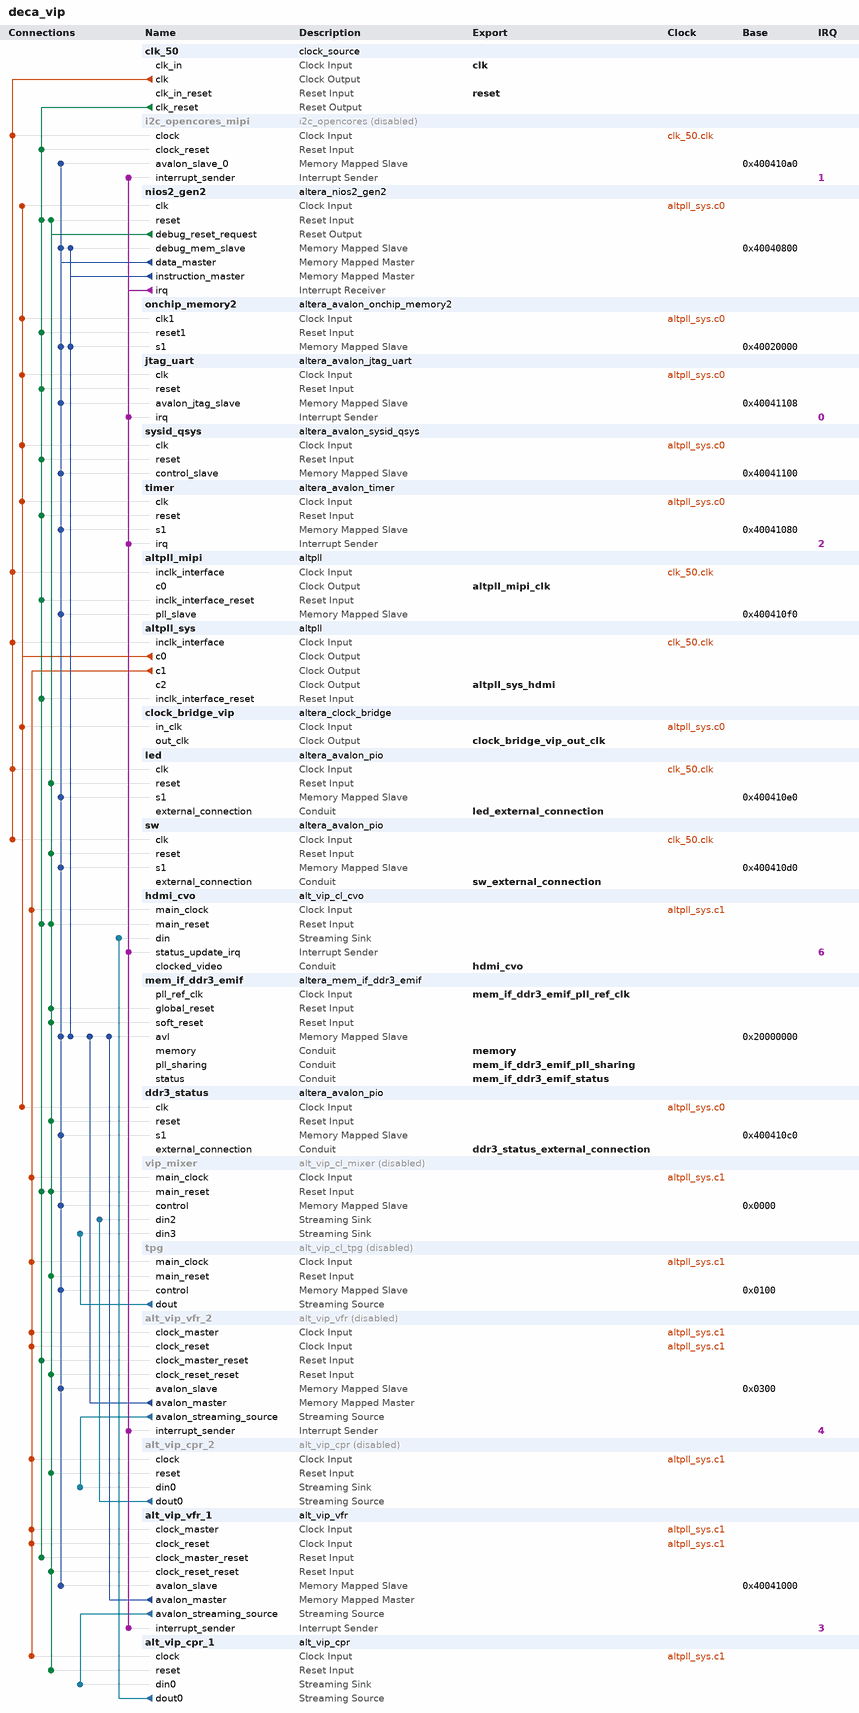
[diagram p0: system contents]
# Platform Designer (Qsys) system deca_vip, MAX 10 10M50DAF484C6GES
# Parameters at their usual value, and those the tool derives, are not listed.
package require -exact qsys 15.0
create_system deca_vip
set_project_property DEVICE_FAMILY {MAX 10}
set_project_property DEVICE 10M50DAF484C6GES

add_instance clk_50 clock_source 15.0
set_instance_parameter_value clk_50 clockFrequency 50000000

add_instance i2c_opencores_mipi i2c_opencores 12.0
set_instance_property i2c_opencores_mipi ENABLED false

add_instance nios2_gen2 altera_nios2_gen2 15.0
set_instance_parameter_value nios2_gen2 dcache_size 2048
set_instance_parameter_value nios2_gen2 exceptionSlave onchip_memory2.s1
set_instance_parameter_value nios2_gen2 icache_size 4096
set_instance_parameter_value nios2_gen2 impl Fast
set_instance_parameter_value nios2_gen2 resetSlave onchip_memory2.s1

add_instance onchip_memory2 altera_avalon_onchip_memory2 15.0
set_instance_parameter_value onchip_memory2 dataWidth 32
set_instance_parameter_value onchip_memory2 dualPort false
set_instance_parameter_value onchip_memory2 initMemContent false
set_instance_parameter_value onchip_memory2 initializationFileName "E:\\SVN\\deca\\amax10\\test\\richard\\DECA_MIPI\\software\\deca_mipi\\mem_init\\deca_qsys_onchip_memory2.hex"
set_instance_parameter_value onchip_memory2 memorySize 70000

add_instance jtag_uart altera_avalon_jtag_uart 15.0
set_instance_parameter_value jtag_uart simInteractiveOptions NO_INTERACTIVE_WINDOWS

add_instance sysid_qsys altera_avalon_sysid_qsys 15.0
set_instance_parameter_value sysid_qsys id 0

add_instance timer altera_avalon_timer 15.0
set_instance_parameter_value timer period 1
set_instance_parameter_value timer periodUnits MSEC

add_instance altpll_mipi altpll 15.0
set_instance_parameter_value altpll_mipi CLK0_DIVIDE_BY 25
set_instance_parameter_value altpll_mipi CLK0_MULTIPLY_BY 12
set_instance_parameter_value altpll_mipi INCLK0_INPUT_FREQUENCY 20000
set_instance_parameter_value altpll_mipi PORT_ARESET PORT_UNUSED
set_instance_parameter_value altpll_mipi PORT_LOCKED PORT_USED
set_instance_parameter_value altpll_mipi PORT_clk1 PORT_UNUSED
set_instance_parameter_value altpll_mipi PORT_clk2 PORT_UNUSED
set_instance_parameter_value altpll_mipi PORT_clk3 PORT_UNUSED

add_instance altpll_sys altpll 15.0
set_instance_parameter_value altpll_sys CLK0_DIVIDE_BY 1
set_instance_parameter_value altpll_sys CLK0_MULTIPLY_BY 2
set_instance_parameter_value altpll_sys CLK1_DIVIDE_BY 1
set_instance_parameter_value altpll_sys CLK1_DUTY_CYCLE 50
set_instance_parameter_value altpll_sys CLK1_MULTIPLY_BY 2
set_instance_parameter_value altpll_sys CLK1_PHASE_SHIFT 0
set_instance_parameter_value altpll_sys CLK2_DIVIDE_BY 3
set_instance_parameter_value altpll_sys CLK2_DUTY_CYCLE 50
set_instance_parameter_value altpll_sys CLK2_MULTIPLY_BY 5
set_instance_parameter_value altpll_sys CLK2_PHASE_SHIFT 0
set_instance_parameter_value altpll_sys INCLK0_INPUT_FREQUENCY 20000
set_instance_parameter_value altpll_sys PORT_ARESET PORT_UNUSED
set_instance_parameter_value altpll_sys PORT_LOCKED PORT_USED
set_instance_parameter_value altpll_sys PORT_clk1 PORT_USED
set_instance_parameter_value altpll_sys PORT_clk2 PORT_USED
set_instance_parameter_value altpll_sys PORT_clk3 PORT_UNUSED

add_instance clock_bridge_vip altera_clock_bridge 15.0
set_instance_parameter_value clock_bridge_vip DERIVED_CLOCK_RATE 100000000
set_instance_parameter_value clock_bridge_vip EXPLICIT_CLOCK_RATE 100000000

add_instance led altera_avalon_pio 15.0
set_instance_parameter_value led direction Output
set_instance_parameter_value led width 8

add_instance sw altera_avalon_pio 15.0
set_instance_parameter_value sw direction Input
set_instance_parameter_value sw width 2

add_instance hdmi_cvo alt_vip_cl_cvo 15.0
set_instance_parameter_value hdmi_cvo ACCEPT_COLOURS_IN_SEQ 0
set_instance_parameter_value hdmi_cvo ANC_LINE 0
set_instance_parameter_value hdmi_cvo AP_LINE 0
set_instance_parameter_value hdmi_cvo BPS 8
set_instance_parameter_value hdmi_cvo CLOCKS_ARE_SAME 0
set_instance_parameter_value hdmi_cvo COLOUR_PLANES_ARE_IN_PARALLEL 1
set_instance_parameter_value hdmi_cvo CONTEXT_WIDTH 8
set_instance_parameter_value hdmi_cvo DST_WIDTH 8
set_instance_parameter_value hdmi_cvo FIELD0_ANC_LINE 0
set_instance_parameter_value hdmi_cvo FIELD0_V_BACK_PORCH 0
set_instance_parameter_value hdmi_cvo FIELD0_V_BLANK 0
set_instance_parameter_value hdmi_cvo FIELD0_V_FRONT_PORCH 0
set_instance_parameter_value hdmi_cvo FIELD0_V_RISING_EDGE 0
set_instance_parameter_value hdmi_cvo FIELD0_V_SYNC_LENGTH 0
set_instance_parameter_value hdmi_cvo FIFO_DEPTH 1280
set_instance_parameter_value hdmi_cvo F_FALLING_EDGE 0
set_instance_parameter_value hdmi_cvo F_RISING_EDGE 0
set_instance_parameter_value hdmi_cvo GENERATE_SYNC 0
set_instance_parameter_value hdmi_cvo H_ACTIVE_PIXELS 1280
set_instance_parameter_value hdmi_cvo H_BACK_PORCH 200
set_instance_parameter_value hdmi_cvo H_BLANK 0
set_instance_parameter_value hdmi_cvo H_FRONT_PORCH 64
set_instance_parameter_value hdmi_cvo H_SYNC_LENGTH 136
set_instance_parameter_value hdmi_cvo INTERLACED 0
set_instance_parameter_value hdmi_cvo NO_OF_CHANNELS 1
set_instance_parameter_value hdmi_cvo NO_OF_MODES 1
set_instance_parameter_value hdmi_cvo NUMBER_OF_COLOUR_PLANES 3
set_instance_parameter_value hdmi_cvo PIXELS_IN_PARALLEL 1
set_instance_parameter_value hdmi_cvo SRC_WIDTH 8
set_instance_parameter_value hdmi_cvo STD_WIDTH 1
set_instance_parameter_value hdmi_cvo TASK_WIDTH 8
set_instance_parameter_value hdmi_cvo THRESHOLD 1279
set_instance_parameter_value hdmi_cvo USE_CONTROL 0
set_instance_parameter_value hdmi_cvo USE_EMBEDDED_SYNCS 0
set_instance_parameter_value hdmi_cvo V_ACTIVE_LINES 800
set_instance_parameter_value hdmi_cvo V_BACK_PORCH 24
set_instance_parameter_value hdmi_cvo V_BLANK 0
set_instance_parameter_value hdmi_cvo V_FRONT_PORCH 1
set_instance_parameter_value hdmi_cvo V_SYNC_LENGTH 3

add_instance mem_if_ddr3_emif altera_mem_if_ddr3_emif 15.0
set_instance_parameter_value mem_if_ddr3_emif AVL_MAX_SIZE 4
set_instance_parameter_value mem_if_ddr3_emif CALIBRATION_MODE Skip
set_instance_parameter_value mem_if_ddr3_emif CPORT_TYPE_PORT Bidirectional,Bidirectional,Bidirectional,Bidirectional,Bidirectional,Bidirectional
set_instance_parameter_value mem_if_ddr3_emif EXPORT_AFI_HALF_CLK false
set_instance_parameter_value mem_if_ddr3_emif HARD_EMIF false
set_instance_parameter_value mem_if_ddr3_emif MEM_BANKADDR_WIDTH 3
set_instance_parameter_value mem_if_ddr3_emif MEM_CLK_FREQ 300.0
set_instance_parameter_value mem_if_ddr3_emif MEM_CLK_FREQ_MAX 800.0
set_instance_parameter_value mem_if_ddr3_emif MEM_COL_ADDR_WIDTH 10
set_instance_parameter_value mem_if_ddr3_emif MEM_DQ_WIDTH 16
set_instance_parameter_value mem_if_ddr3_emif MEM_FORMAT DISCRETE
set_instance_parameter_value mem_if_ddr3_emif MEM_ROW_ADDR_WIDTH 15
set_instance_parameter_value mem_if_ddr3_emif MEM_TCL 7
set_instance_parameter_value mem_if_ddr3_emif MEM_TFAW_NS 45.0
set_instance_parameter_value mem_if_ddr3_emif MEM_TRAS_NS 35.0
set_instance_parameter_value mem_if_ddr3_emif MEM_TRCD_NS 13.75
set_instance_parameter_value mem_if_ddr3_emif MEM_TRFC_NS 260.0
set_instance_parameter_value mem_if_ddr3_emif MEM_TRP_NS 13.75
set_instance_parameter_value mem_if_ddr3_emif MEM_TRRD_NS 7.5
set_instance_parameter_value mem_if_ddr3_emif MEM_TRTP_NS 7.5
set_instance_parameter_value mem_if_ddr3_emif MEM_TWTR 6
set_instance_parameter_value mem_if_ddr3_emif MEM_VENDOR Micron
set_instance_parameter_value mem_if_ddr3_emif MEM_WTCL 6
set_instance_parameter_value mem_if_ddr3_emif PLL_LOCATION Top_Bottom
set_instance_parameter_value mem_if_ddr3_emif POWER_OF_TWO_BUS true
set_instance_parameter_value mem_if_ddr3_emif PRIORITY_PORT 1,1,1,1,1,1
set_instance_parameter_value mem_if_ddr3_emif RATE Half
set_instance_parameter_value mem_if_ddr3_emif REF_CLK_FREQ 50.0
set_instance_parameter_value mem_if_ddr3_emif SPEED_GRADE 6
set_instance_parameter_value mem_if_ddr3_emif TIMING_BOARD_AC_SKEW 0.017
set_instance_parameter_value mem_if_ddr3_emif TIMING_BOARD_AC_TO_CK_SKEW -1.3E-4
set_instance_parameter_value mem_if_ddr3_emif TIMING_BOARD_DQ_TO_DQS_SKEW -6.0E-4
set_instance_parameter_value mem_if_ddr3_emif TIMING_BOARD_MAX_CK_DELAY 0.183
set_instance_parameter_value mem_if_ddr3_emif TIMING_BOARD_MAX_DQS_DELAY 0.181
set_instance_parameter_value mem_if_ddr3_emif TIMING_BOARD_SKEW_BETWEEN_DQS 0.005
set_instance_parameter_value mem_if_ddr3_emif TIMING_BOARD_SKEW_CKDQS_DIMM_MAX 0.007
set_instance_parameter_value mem_if_ddr3_emif TIMING_BOARD_SKEW_CKDQS_DIMM_MIN 0.002
set_instance_parameter_value mem_if_ddr3_emif TIMING_BOARD_SKEW_WITHIN_DQS 0.008
set_instance_parameter_value mem_if_ddr3_emif TIMING_TDH 55
set_instance_parameter_value mem_if_ddr3_emif TIMING_TDQSCK 225
set_instance_parameter_value mem_if_ddr3_emif TIMING_TDQSQ 125
set_instance_parameter_value mem_if_ddr3_emif TIMING_TDQSS 0.25
set_instance_parameter_value mem_if_ddr3_emif TIMING_TDS 55
set_instance_parameter_value mem_if_ddr3_emif TIMING_TDSH 0.2
set_instance_parameter_value mem_if_ddr3_emif TIMING_TDSS 0.2
set_instance_parameter_value mem_if_ddr3_emif TIMING_TIH 130
set_instance_parameter_value mem_if_ddr3_emif TIMING_TIS 185
set_instance_parameter_value mem_if_ddr3_emif TIMING_TQSH 0.4
set_instance_parameter_value mem_if_ddr3_emif USER_DEBUG_LEVEL 1

add_instance ddr3_status altera_avalon_pio 15.0
set_instance_parameter_value ddr3_status direction Input
set_instance_parameter_value ddr3_status width 4

add_instance vip_mixer alt_vip_cl_mixer 15.0
set_instance_property vip_mixer ENABLED false
set_instance_parameter_value vip_mixer BITS_PER_SYMBOL 8
set_instance_parameter_value vip_mixer COLOR_PLANES_ARE_IN_PARALLEL 1
set_instance_parameter_value vip_mixer COLOR_SPACE RGB
set_instance_parameter_value vip_mixer FAMILY {MAX 10}
set_instance_parameter_value vip_mixer MAX_HEIGHT 800
set_instance_parameter_value vip_mixer MAX_WIDTH 1280
set_instance_parameter_value vip_mixer NUMBER_OF_COLOR_PLANES 3
set_instance_parameter_value vip_mixer OUTPUT_FORMAT 4.4.4
set_instance_parameter_value vip_mixer PATTERN uniform
set_instance_parameter_value vip_mixer PIXELS_IN_PARALLEL 1
set_instance_parameter_value vip_mixer RUNTIME_CONTROL 1
set_instance_parameter_value vip_mixer UNIFORM_VALUE_BCR 160
set_instance_parameter_value vip_mixer UNIFORM_VALUE_GCB 160
set_instance_parameter_value vip_mixer UNIFORM_VALUE_RY 0

add_instance tpg alt_vip_cl_tpg 15.0
set_instance_property tpg ENABLED false
set_instance_parameter_value tpg BPS 8
set_instance_parameter_value tpg COLOR_PLANES_ARE_IN_PARALLEL 1
set_instance_parameter_value tpg COLOR_SPACE RGB
set_instance_parameter_value tpg FAMILY {MAX 10}
set_instance_parameter_value tpg INTERLACING prog
set_instance_parameter_value tpg MAX_HEIGHT 480
set_instance_parameter_value tpg MAX_WIDTH 640
set_instance_parameter_value tpg OUTPUT_FORMAT 4.4.4
set_instance_parameter_value tpg PATTERN colorbars
set_instance_parameter_value tpg PIXELS_IN_PARALLEL 1
set_instance_parameter_value tpg RUNTIME_CONTROL 1
set_instance_parameter_value tpg UNIFORM_VALUE_BCR 16
set_instance_parameter_value tpg UNIFORM_VALUE_GCB 16
set_instance_parameter_value tpg UNIFORM_VALUE_RY 16

add_instance alt_vip_vfr_2 alt_vip_vfr 14.0
set_instance_property alt_vip_vfr_2 ENABLED false
set_instance_parameter_value alt_vip_vfr_2 MAX_IMAGE_HEIGHT 480
set_instance_parameter_value alt_vip_vfr_2 MAX_IMAGE_WIDTH 640
set_instance_parameter_value alt_vip_vfr_2 MEM_PORT_WIDTH 256
set_instance_parameter_value alt_vip_vfr_2 RMASTER_FIFO_DEPTH 1024

add_instance alt_vip_cpr_2 alt_vip_cpr 13.1
set_instance_property alt_vip_cpr_2 ENABLED false
set_instance_parameter_value alt_vip_cpr_2 DIN0_SYMBOLS_PER_BEAT 4
set_instance_parameter_value alt_vip_cpr_2 DIN1_ENABLED 0
set_instance_parameter_value alt_vip_cpr_2 DIN1_SYMBOLS_PER_BEAT 0
set_instance_parameter_value alt_vip_cpr_2 DOUT0_SYMBOLS_PER_BEAT 3
set_instance_parameter_value alt_vip_cpr_2 DOUT1_ENABLED 0
set_instance_parameter_value alt_vip_cpr_2 DOUT1_SYMBOLS_PER_BEAT 0
set_instance_parameter_value alt_vip_cpr_2 PARAMETERISATION {<colourPatternRearrangerParams><CPR_NAME>Color Plane Sequencer</CPR_NAME><CPR_BPS>8</CPR_BPS><CPR_PORTS><INPUT_PORT><NAME>din0</NAME><STREAMING_DESCRIPTOR>[A:B:C:discard]</STREAMING_DESCRIPTOR><ENABLED>true</ENABLED></INPUT_PORT><INPUT_PORT><NAME>din1</NAME><STREAMING_DESCRIPTOR>[Channel]</STREAMING_DESCRIPTOR><ENABLED>false</ENABLED></INPUT_PORT><OUTPUT_PORT><NAME>dout0</NAME><STREAMING_DESCRIPTOR>[A:B:C]</STREAMING_DESCRIPTOR><ENABLED>true</ENABLED><NON_IMAGE_PACKET_SOURCE>din0</NON_IMAGE_PACKET_SOURCE><HALVE_WIDTH>false</HALVE_WIDTH></OUTPUT_PORT><OUTPUT_PORT><NAME>dout1</NAME><STREAMING_DESCRIPTOR>[Channel]</STREAMING_DESCRIPTOR><ENABLED>false</ENABLED><NON_IMAGE_PACKET_SOURCE>din0</NON_IMAGE_PACKET_SOURCE><HALVE_WIDTH>false</HALVE_WIDTH></OUTPUT_PORT></CPR_PORTS><CPR_INPUT_2_PIXELS>false</CPR_INPUT_2_PIXELS></colourPatternRearrangerParams>}

add_instance alt_vip_vfr_1 alt_vip_vfr 14.0
set_instance_parameter_value alt_vip_vfr_1 MAX_IMAGE_HEIGHT 800
set_instance_parameter_value alt_vip_vfr_1 MAX_IMAGE_WIDTH 1280
set_instance_parameter_value alt_vip_vfr_1 MEM_PORT_WIDTH 256
set_instance_parameter_value alt_vip_vfr_1 RMASTER_FIFO_DEPTH 1024

add_instance alt_vip_cpr_1 alt_vip_cpr 13.1
set_instance_parameter_value alt_vip_cpr_1 DIN0_SYMBOLS_PER_BEAT 4
set_instance_parameter_value alt_vip_cpr_1 DIN1_ENABLED 0
set_instance_parameter_value alt_vip_cpr_1 DIN1_SYMBOLS_PER_BEAT 0
set_instance_parameter_value alt_vip_cpr_1 DOUT0_SYMBOLS_PER_BEAT 3
set_instance_parameter_value alt_vip_cpr_1 DOUT1_ENABLED 0
set_instance_parameter_value alt_vip_cpr_1 DOUT1_SYMBOLS_PER_BEAT 0
set_instance_parameter_value alt_vip_cpr_1 PARAMETERISATION {<colourPatternRearrangerParams><CPR_NAME>Color Plane Sequencer</CPR_NAME><CPR_BPS>8</CPR_BPS><CPR_PORTS><INPUT_PORT><NAME>din0</NAME><STREAMING_DESCRIPTOR>[A:B:C:unnamed]</STREAMING_DESCRIPTOR><ENABLED>true</ENABLED></INPUT_PORT><INPUT_PORT><NAME>din1</NAME><STREAMING_DESCRIPTOR>[Channel]</STREAMING_DESCRIPTOR><ENABLED>false</ENABLED></INPUT_PORT><OUTPUT_PORT><NAME>dout0</NAME><STREAMING_DESCRIPTOR>[A:B:C]</STREAMING_DESCRIPTOR><ENABLED>true</ENABLED><NON_IMAGE_PACKET_SOURCE>din0</NON_IMAGE_PACKET_SOURCE><HALVE_WIDTH>false</HALVE_WIDTH></OUTPUT_PORT><OUTPUT_PORT><NAME>dout1</NAME><STREAMING_DESCRIPTOR>[Channel]</STREAMING_DESCRIPTOR><ENABLED>false</ENABLED><NON_IMAGE_PACKET_SOURCE>din0</NON_IMAGE_PACKET_SOURCE><HALVE_WIDTH>false</HALVE_WIDTH></OUTPUT_PORT></CPR_PORTS><CPR_INPUT_2_PIXELS>false</CPR_INPUT_2_PIXELS></colourPatternRearrangerParams>}

# connections
add_connection altpll_sys.c0 clock_bridge_vip.in_clk clock
add_connection altpll_sys.c0 ddr3_status.clk clock
add_connection altpll_sys.c0 jtag_uart.clk clock
add_connection altpll_sys.c0 nios2_gen2.clk clock
add_connection altpll_sys.c0 onchip_memory2.clk1 clock
add_connection altpll_sys.c0 sysid_qsys.clk clock
add_connection altpll_sys.c0 timer.clk clock
add_connection altpll_sys.c1 alt_vip_cpr_1.clock clock
add_connection altpll_sys.c1 alt_vip_cpr_2.clock clock
add_connection altpll_sys.c1 alt_vip_vfr_1.clock_master clock
add_connection altpll_sys.c1 alt_vip_vfr_1.clock_reset clock
add_connection altpll_sys.c1 alt_vip_vfr_2.clock_master clock
add_connection altpll_sys.c1 alt_vip_vfr_2.clock_reset clock
add_connection altpll_sys.c1 hdmi_cvo.main_clock clock
add_connection altpll_sys.c1 tpg.main_clock clock
add_connection altpll_sys.c1 vip_mixer.main_clock clock
add_connection clk_50.clk altpll_mipi.inclk_interface clock
add_connection clk_50.clk altpll_sys.inclk_interface clock
add_connection clk_50.clk i2c_opencores_mipi.clock clock
add_connection clk_50.clk led.clk clock
add_connection clk_50.clk sw.clk clock
add_connection clk_50.clk_reset alt_vip_vfr_1.clock_master_reset reset
add_connection clk_50.clk_reset alt_vip_vfr_2.clock_master_reset reset
add_connection clk_50.clk_reset altpll_mipi.inclk_interface_reset reset
add_connection clk_50.clk_reset altpll_sys.inclk_interface_reset reset
add_connection clk_50.clk_reset hdmi_cvo.main_reset reset
add_connection clk_50.clk_reset i2c_opencores_mipi.clock_reset reset
add_connection clk_50.clk_reset jtag_uart.reset reset
add_connection clk_50.clk_reset nios2_gen2.reset reset
add_connection clk_50.clk_reset onchip_memory2.reset1 reset
add_connection clk_50.clk_reset sysid_qsys.reset reset
add_connection clk_50.clk_reset timer.reset reset
add_connection clk_50.clk_reset vip_mixer.main_reset reset
add_connection nios2_gen2.debug_reset_request alt_vip_cpr_1.reset reset
add_connection nios2_gen2.debug_reset_request alt_vip_cpr_2.reset reset
add_connection nios2_gen2.debug_reset_request alt_vip_vfr_1.clock_reset_reset reset
add_connection nios2_gen2.debug_reset_request alt_vip_vfr_2.clock_reset_reset reset
add_connection nios2_gen2.debug_reset_request ddr3_status.reset reset
add_connection nios2_gen2.debug_reset_request hdmi_cvo.main_reset reset
add_connection nios2_gen2.debug_reset_request led.reset reset
add_connection nios2_gen2.debug_reset_request mem_if_ddr3_emif.global_reset reset
add_connection nios2_gen2.debug_reset_request mem_if_ddr3_emif.soft_reset reset
add_connection nios2_gen2.debug_reset_request nios2_gen2.reset reset
add_connection nios2_gen2.debug_reset_request sw.reset reset
add_connection nios2_gen2.debug_reset_request tpg.main_reset reset
add_connection nios2_gen2.debug_reset_request vip_mixer.main_reset reset
add_connection alt_vip_vfr_1.avalon_master mem_if_ddr3_emif.avl avalon
set_connection_parameter_value alt_vip_vfr_1.avalon_master/mem_if_ddr3_emif.avl baseAddress 0x20000000
add_connection alt_vip_vfr_2.avalon_master mem_if_ddr3_emif.avl avalon
set_connection_parameter_value alt_vip_vfr_2.avalon_master/mem_if_ddr3_emif.avl baseAddress 0x20000000
add_connection nios2_gen2.data_master alt_vip_vfr_1.avalon_slave avalon
set_connection_parameter_value nios2_gen2.data_master/alt_vip_vfr_1.avalon_slave baseAddress 0x40041000
add_connection nios2_gen2.data_master alt_vip_vfr_2.avalon_slave avalon
set_connection_parameter_value nios2_gen2.data_master/alt_vip_vfr_2.avalon_slave baseAddress 0x0300
add_connection nios2_gen2.data_master altpll_mipi.pll_slave avalon
set_connection_parameter_value nios2_gen2.data_master/altpll_mipi.pll_slave baseAddress 0x400410f0
add_connection nios2_gen2.data_master ddr3_status.s1 avalon
set_connection_parameter_value nios2_gen2.data_master/ddr3_status.s1 baseAddress 0x400410c0
add_connection nios2_gen2.data_master i2c_opencores_mipi.avalon_slave_0 avalon
set_connection_parameter_value nios2_gen2.data_master/i2c_opencores_mipi.avalon_slave_0 baseAddress 0x400410a0
add_connection nios2_gen2.data_master jtag_uart.avalon_jtag_slave avalon
set_connection_parameter_value nios2_gen2.data_master/jtag_uart.avalon_jtag_slave baseAddress 0x40041108
add_connection nios2_gen2.data_master led.s1 avalon
set_connection_parameter_value nios2_gen2.data_master/led.s1 baseAddress 0x400410e0
add_connection nios2_gen2.data_master mem_if_ddr3_emif.avl avalon
set_connection_parameter_value nios2_gen2.data_master/mem_if_ddr3_emif.avl baseAddress 0x20000000
add_connection nios2_gen2.data_master nios2_gen2.debug_mem_slave avalon
set_connection_parameter_value nios2_gen2.data_master/nios2_gen2.debug_mem_slave baseAddress 0x40040800
add_connection nios2_gen2.data_master onchip_memory2.s1 avalon
set_connection_parameter_value nios2_gen2.data_master/onchip_memory2.s1 baseAddress 0x40020000
add_connection nios2_gen2.data_master sw.s1 avalon
set_connection_parameter_value nios2_gen2.data_master/sw.s1 baseAddress 0x400410d0
add_connection nios2_gen2.data_master sysid_qsys.control_slave avalon
set_connection_parameter_value nios2_gen2.data_master/sysid_qsys.control_slave baseAddress 0x40041100
add_connection nios2_gen2.data_master timer.s1 avalon
set_connection_parameter_value nios2_gen2.data_master/timer.s1 baseAddress 0x40041080
add_connection nios2_gen2.data_master tpg.control avalon
set_connection_parameter_value nios2_gen2.data_master/tpg.control baseAddress 0x0100
add_connection nios2_gen2.data_master vip_mixer.control avalon
set_connection_parameter_value nios2_gen2.data_master/vip_mixer.control baseAddress 0x0000
add_connection nios2_gen2.instruction_master mem_if_ddr3_emif.avl avalon
set_connection_parameter_value nios2_gen2.instruction_master/mem_if_ddr3_emif.avl baseAddress 0x20000000
add_connection nios2_gen2.instruction_master nios2_gen2.debug_mem_slave avalon
set_connection_parameter_value nios2_gen2.instruction_master/nios2_gen2.debug_mem_slave baseAddress 0x40040800
add_connection nios2_gen2.instruction_master onchip_memory2.s1 avalon
set_connection_parameter_value nios2_gen2.instruction_master/onchip_memory2.s1 baseAddress 0x40020000
add_connection alt_vip_cpr_1.dout0 hdmi_cvo.din avalon_streaming
add_connection alt_vip_cpr_2.dout0 vip_mixer.din2 avalon_streaming
add_connection alt_vip_vfr_1.avalon_streaming_source alt_vip_cpr_1.din0 avalon_streaming
add_connection alt_vip_vfr_2.avalon_streaming_source alt_vip_cpr_2.din0 avalon_streaming
add_connection tpg.dout vip_mixer.din3 avalon_streaming
add_connection nios2_gen2.irq alt_vip_vfr_1.interrupt_sender interrupt
set_connection_parameter_value nios2_gen2.irq/alt_vip_vfr_1.interrupt_sender irqNumber 3
add_connection nios2_gen2.irq alt_vip_vfr_2.interrupt_sender interrupt
set_connection_parameter_value nios2_gen2.irq/alt_vip_vfr_2.interrupt_sender irqNumber 4
add_connection nios2_gen2.irq hdmi_cvo.status_update_irq interrupt
set_connection_parameter_value nios2_gen2.irq/hdmi_cvo.status_update_irq irqNumber 6
add_connection nios2_gen2.irq i2c_opencores_mipi.interrupt_sender interrupt
set_connection_parameter_value nios2_gen2.irq/i2c_opencores_mipi.interrupt_sender irqNumber 1
add_connection nios2_gen2.irq jtag_uart.irq interrupt
set_connection_parameter_value nios2_gen2.irq/jtag_uart.irq irqNumber 0
add_connection nios2_gen2.irq timer.irq interrupt
set_connection_parameter_value nios2_gen2.irq/timer.irq irqNumber 2

# exported interfaces
add_interface altpll_mipi_clk clock source
set_interface_property altpll_mipi_clk EXPORT_OF altpll_mipi.c0
add_interface altpll_sys_hdmi clock source
set_interface_property altpll_sys_hdmi EXPORT_OF altpll_sys.c2
add_interface clk clock sink
set_interface_property clk EXPORT_OF clk_50.clk_in
add_interface clock_bridge_vip_out_clk clock source
set_interface_property clock_bridge_vip_out_clk EXPORT_OF clock_bridge_vip.out_clk
add_interface ddr3_status_external_connection conduit end
set_interface_property ddr3_status_external_connection EXPORT_OF ddr3_status.external_connection
add_interface hdmi_cvo conduit end
set_interface_property hdmi_cvo EXPORT_OF hdmi_cvo.clocked_video
add_interface led_external_connection conduit end
set_interface_property led_external_connection EXPORT_OF led.external_connection
add_interface mem_if_ddr3_emif_pll_ref_clk clock sink
set_interface_property mem_if_ddr3_emif_pll_ref_clk EXPORT_OF mem_if_ddr3_emif.pll_ref_clk
add_interface mem_if_ddr3_emif_pll_sharing conduit end
set_interface_property mem_if_ddr3_emif_pll_sharing EXPORT_OF mem_if_ddr3_emif.pll_sharing
add_interface mem_if_ddr3_emif_status conduit end
set_interface_property mem_if_ddr3_emif_status EXPORT_OF mem_if_ddr3_emif.status
add_interface memory conduit end
set_interface_property memory EXPORT_OF mem_if_ddr3_emif.memory
add_interface reset reset sink
set_interface_property reset EXPORT_OF clk_50.clk_in_reset
add_interface sw_external_connection conduit end
set_interface_property sw_external_connection EXPORT_OF sw.external_connection

set_interconnect_requirement {$system} qsys_mm.clockCrossingAdapter HANDSHAKE
set_interconnect_requirement {$system} qsys_mm.insertDefaultSlave FALSE
set_interconnect_requirement {$system} qsys_mm.maxAdditionalLatency 1

save_system deca_vip.qsys
